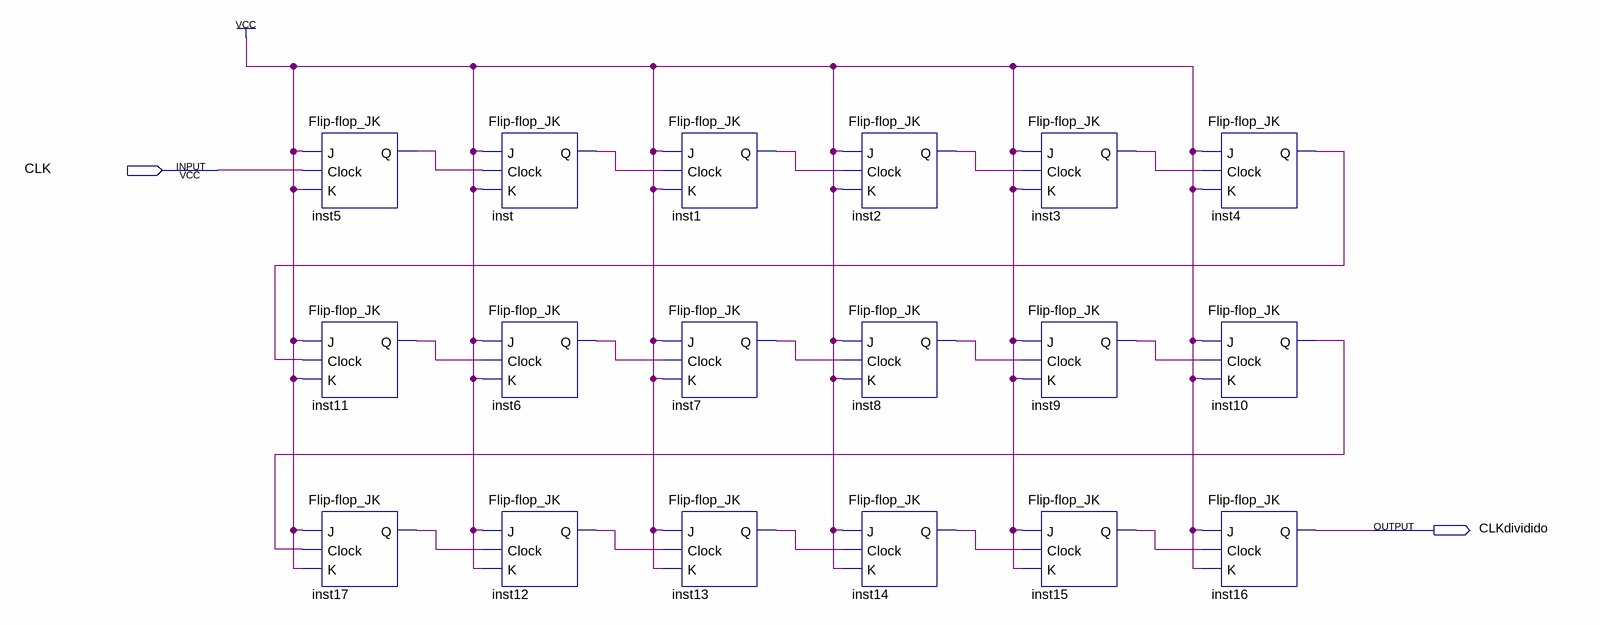
[diagram p0: schematic sheet]
// Quartus schematic divisorDeFrequencia.bdf as structural Verilog: 18 symbols, 2 pins
module divisorDeFrequencia (
  input  CLK,
  output CLKdividido
);

  wire inst1_q, inst2_q, inst3_q, inst4_q, inst5_q, inst6_q, inst7_q, inst8_q, inst9_q, inst10_q, inst11_q,
       inst12_q, inst13_q, inst14_q, inst15_q, inst17_q, inst_q;

  \Flip-flop_JK  inst5 (.J(1'b1), .Clock(CLK), .K(1'b1), .Q(inst5_q));
  \Flip-flop_JK  inst11 (.J(1'b1), .Clock(inst4_q), .K(1'b1), .Q(inst11_q));
  \Flip-flop_JK  inst17 (.J(1'b1), .Clock(inst10_q), .K(1'b1), .Q(inst17_q));
  \Flip-flop_JK  inst (.J(1'b1), .Clock(inst5_q), .K(1'b1), .Q(inst_q));
  \Flip-flop_JK  inst6 (.J(1'b1), .Clock(inst11_q), .K(1'b1), .Q(inst6_q));
  \Flip-flop_JK  inst12 (.J(1'b1), .Clock(inst17_q), .K(1'b1), .Q(inst12_q));
  \Flip-flop_JK  inst1 (.J(1'b1), .Clock(inst_q), .K(1'b1), .Q(inst1_q));
  \Flip-flop_JK  inst7 (.J(1'b1), .Clock(inst6_q), .K(1'b1), .Q(inst7_q));
  \Flip-flop_JK  inst13 (.J(1'b1), .Clock(inst12_q), .K(1'b1), .Q(inst13_q));
  \Flip-flop_JK  inst2 (.J(1'b1), .Clock(inst1_q), .K(1'b1), .Q(inst2_q));
  \Flip-flop_JK  inst8 (.J(1'b1), .Clock(inst7_q), .K(1'b1), .Q(inst8_q));
  \Flip-flop_JK  inst14 (.J(1'b1), .Clock(inst13_q), .K(1'b1), .Q(inst14_q));
  \Flip-flop_JK  inst3 (.J(1'b1), .Clock(inst2_q), .K(1'b1), .Q(inst3_q));
  \Flip-flop_JK  inst9 (.J(1'b1), .Clock(inst8_q), .K(1'b1), .Q(inst9_q));
  \Flip-flop_JK  inst15 (.J(1'b1), .Clock(inst14_q), .K(1'b1), .Q(inst15_q));
  \Flip-flop_JK  inst4 (.J(1'b1), .Clock(inst3_q), .K(1'b1), .Q(inst4_q));
  \Flip-flop_JK  inst10 (.J(1'b1), .Clock(inst9_q), .K(1'b1), .Q(inst10_q));
  \Flip-flop_JK  inst16 (.J(1'b1), .Clock(inst15_q), .K(1'b1), .Q(CLKdividido));
endmodule
